# Altium project BCD_TO_7SEG_MODULE.PrjPcb (part 1 of 2)
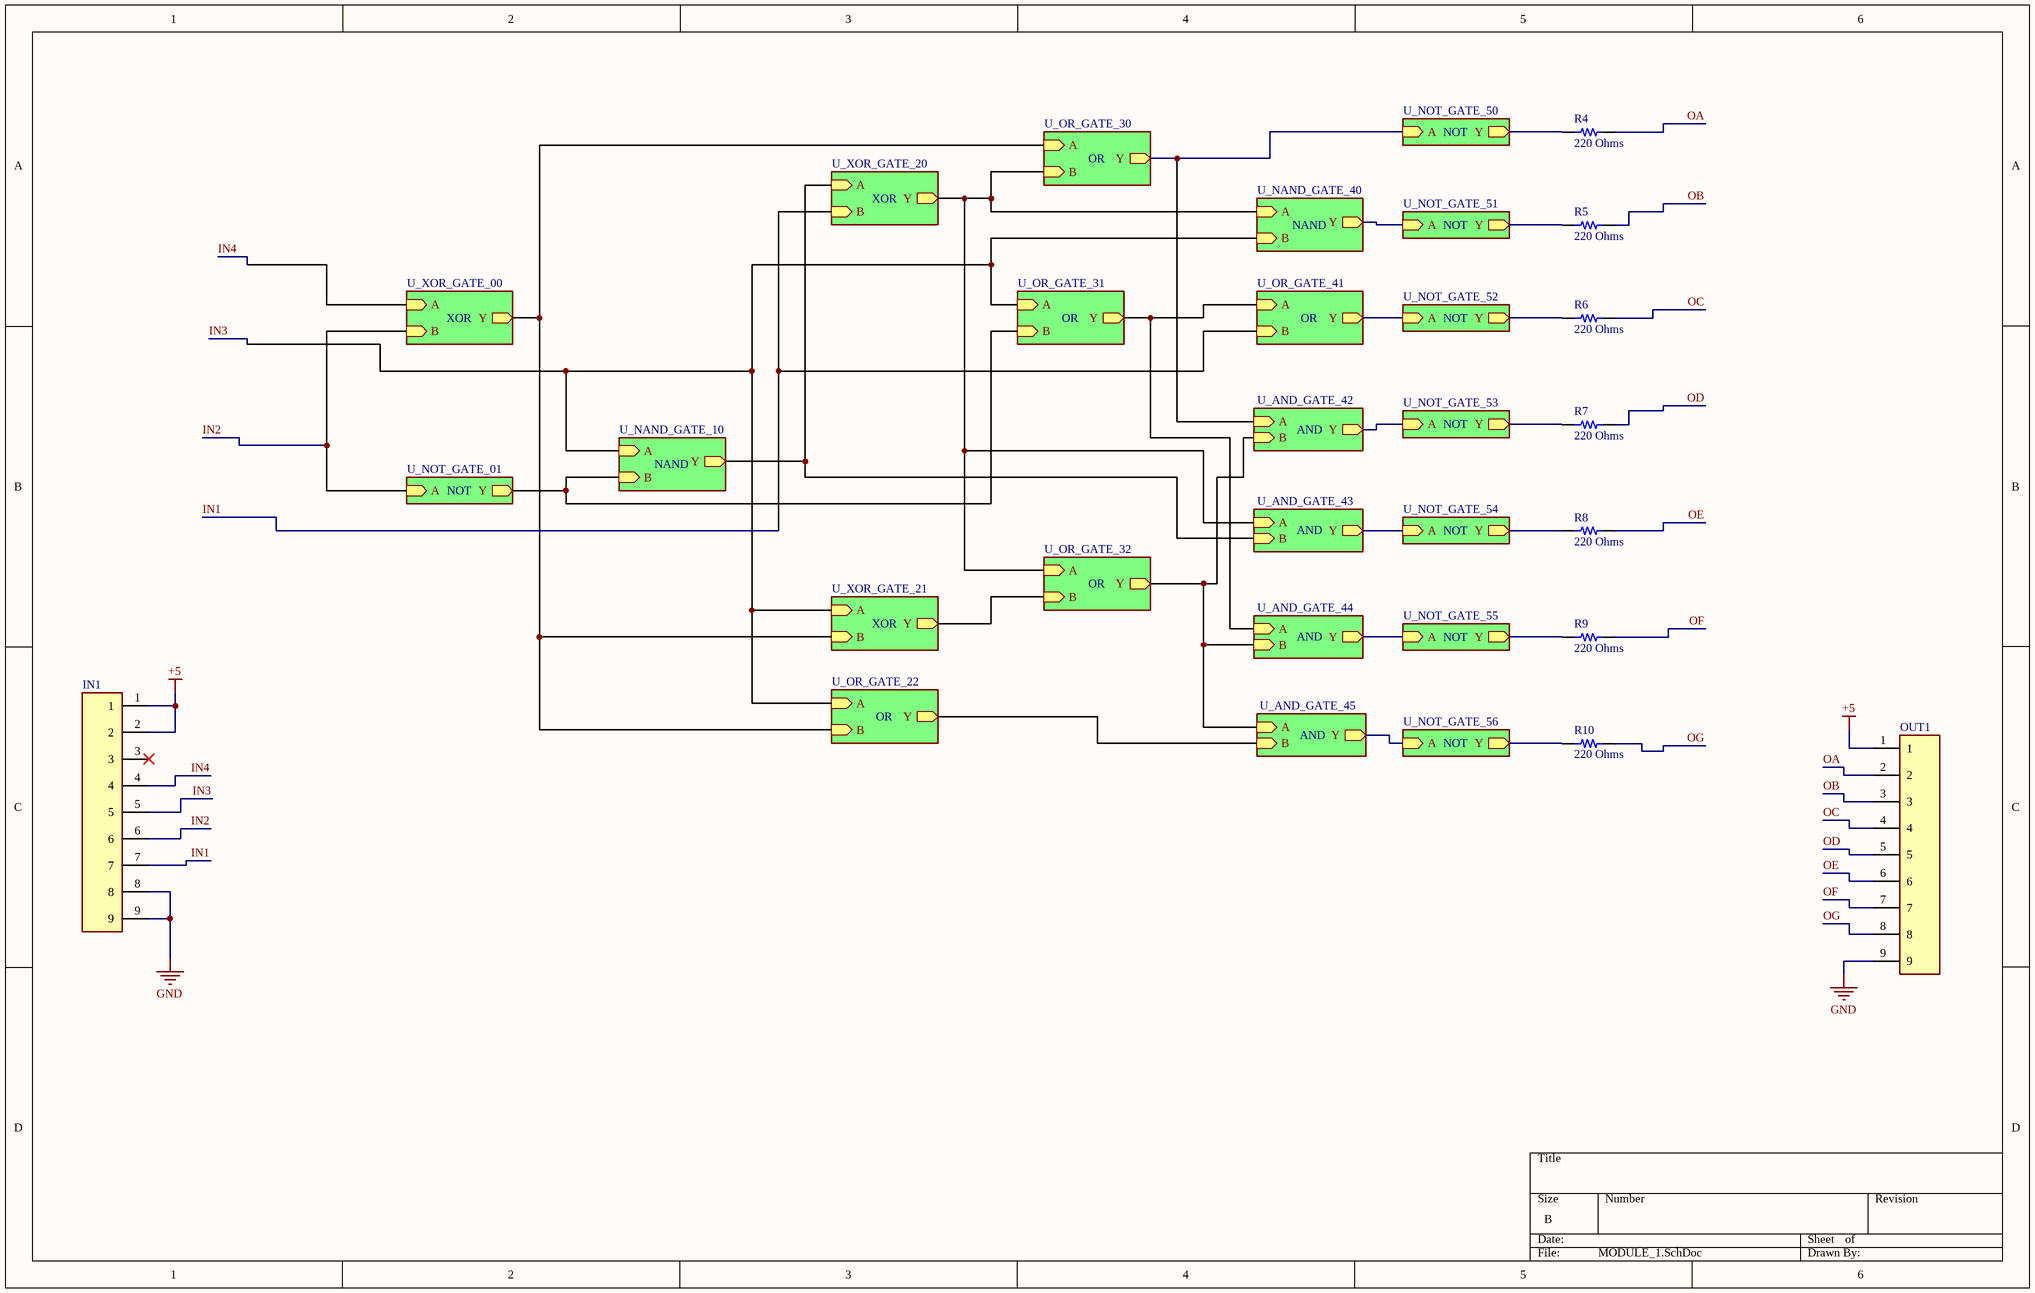
[diagram p0: MODULE_1.SchDoc]
6 sheets, 377 parts. Net scope: hierarchical (ports join the sheet entries above them; power ports are global).
Board file: PCB_V0.PcbDoc
Sheets:
  MODULE_1.SchDoc
    U_XOR_GATE_00 = XOR_GATE.SchDoc
    U_NOT_GATE_01 = NOT_GATE.SchDoc
    U_OR_GATE_22 = OR_GATE.SchDoc
    U_AND_GATE_42 = AND_GATE.SchDoc
    U_NAND_GATE_10 = NAND_GATE.SchDoc
    U_XOR_GATE_20 = XOR_GATE.SchDoc
    U_XOR_GATE_21 = XOR_GATE.SchDoc
    U_OR_GATE_30 = OR_GATE.SchDoc
    U_OR_GATE_31 = OR_GATE.SchDoc
    U_OR_GATE_32 = OR_GATE.SchDoc
    U_NAND_GATE_40 = NAND_GATE.SchDoc
    U_OR_GATE_41 = OR_GATE.SchDoc
    U_AND_GATE_43 = AND_GATE.SchDoc
    U_AND_GATE_44 = AND_GATE.SchDoc
    U_AND_GATE_45 = AND_GATE.SchDoc
    U_NOT_GATE_50 = NOT_GATE.SchDoc
    U_NOT_GATE_51 = NOT_GATE.SchDoc
    U_NOT_GATE_52 = NOT_GATE.SchDoc
    U_NOT_GATE_53 = NOT_GATE.SchDoc
    U_NOT_GATE_54 = NOT_GATE.SchDoc
    U_NOT_GATE_55 = NOT_GATE.SchDoc
    U_NOT_GATE_56 = NOT_GATE.SchDoc

## Sheet MODULE_1.SchDoc
size B

### Parts
IN1  2.54mm_TH_1x9_pin_header  [2.54mm_TH_1x9_pin_header]  (value not drawn)
OUT1  2.54mm_TH_1x9_pin_header  [2.54mm_TH_1x9_pin_header]  (value not drawn)
R4  220 Ohms  [RES 0603_1608]
R5  220 Ohms  [RES 0603_1608]
R6  220 Ohms  [RES 0603_1608]
R7  220 Ohms  [RES 0603_1608]
R8  220 Ohms  [RES 0603_1608]
R9  220 Ohms  [RES 0603_1608]
R10  220 Ohms  [RES 0603_1608]

### Sub-sheets
U_AND_GATE_42 = AND_GATE.SchDoc: Y (out), A (in), B (in)
U_AND_GATE_43 = AND_GATE.SchDoc: Y (out), A (in), B (in)
U_AND_GATE_44 = AND_GATE.SchDoc: Y (out), A (in), B (in)
U_AND_GATE_45 = AND_GATE.SchDoc: Y (out), A (in), B (in)
U_NAND_GATE_10 = NAND_GATE.SchDoc: Y (out), A (in), B (in)
U_NAND_GATE_40 = NAND_GATE.SchDoc: Y (out), A (in), B (in)
U_NOT_GATE_01 = NOT_GATE.SchDoc: Y (out), A (in)
U_NOT_GATE_50 = NOT_GATE.SchDoc: Y (out), A (in)
U_NOT_GATE_51 = NOT_GATE.SchDoc: Y (out), A (in)
U_NOT_GATE_52 = NOT_GATE.SchDoc: Y (out), A (in)
U_NOT_GATE_53 = NOT_GATE.SchDoc: Y (out), A (in)
U_NOT_GATE_54 = NOT_GATE.SchDoc: Y (out), A (in)
U_NOT_GATE_55 = NOT_GATE.SchDoc: Y (out), A (in)
U_NOT_GATE_56 = NOT_GATE.SchDoc: Y (out), A (in)
U_OR_GATE_22 = OR_GATE.SchDoc: Y (out), A (in), B (in)
U_OR_GATE_30 = OR_GATE.SchDoc: Y (out), A (in), B (in)
U_OR_GATE_31 = OR_GATE.SchDoc: Y (out), A (in), B (in)
U_OR_GATE_32 = OR_GATE.SchDoc: Y (out), A (in), B (in)
U_OR_GATE_41 = OR_GATE.SchDoc: Y (out), A (in), B (in)
U_XOR_GATE_00 = XOR_GATE.SchDoc: Y (out), A (in), B (in)
U_XOR_GATE_20 = XOR_GATE.SchDoc: Y (out), A (in), B (in)
U_XOR_GATE_21 = XOR_GATE.SchDoc: Y (out), A (in), B (in)

### Nets
+5: IN1.1 IN1.2 OUT1.1
GND: IN1.8 IN1.9 OUT1.9
IN1: IN1.7 ; sheet U_XOR_GATE_20/B, sheet U_OR_GATE_41/B
IN2: IN1.6 ; sheet U_XOR_GATE_00/B, sheet U_NOT_GATE_01/A
IN3: IN1.5 ; sheet U_OR_GATE_22/A, sheet U_NAND_GATE_10/A, sheet U_XOR_GATE_21/A, sheet U_OR_GATE_31/A, sheet U_NAND_GATE_40/B
IN4: IN1.4 ; sheet U_XOR_GATE_00/A
OA: OUT1.2 R4.2
OB: OUT1.3 R5.2
OC: OUT1.4 R6.2
OD: OUT1.5 R7.2
OE: OUT1.6 R8.2
OF: OUT1.7 R9.2
OG: OUT1.8 R10.2
NetAIN_R1_U_AND_GATE_42_2: sheet U_AND_GATE_42/A, sheet U_OR_GATE_30/Y, sheet U_NOT_GATE_50/A
NetAIN_R1_U_AND_GATE_43_2: sheet U_XOR_GATE_20/Y, sheet U_OR_GATE_30/B, sheet U_OR_GATE_32/A, sheet U_NAND_GATE_40/A, sheet U_AND_GATE_43/A
NetAIN_R1_U_AND_GATE_44_2: sheet U_OR_GATE_31/Y, sheet U_OR_GATE_41/A, sheet U_AND_GATE_44/A
NetAIN_R1_U_AND_GATE_45_2: sheet U_AND_GATE_42/B, sheet U_OR_GATE_32/Y, sheet U_AND_GATE_44/B, sheet U_AND_GATE_45/A
NetAIN_R2_U_OR_GATE_30_2: sheet U_XOR_GATE_00/Y, sheet U_OR_GATE_22/B, sheet U_XOR_GATE_21/B, sheet U_OR_GATE_30/A
NetAIN_R3_U_NOT_GATE_51_2: sheet U_NAND_GATE_40/Y, sheet U_NOT_GATE_51/A
NetAIN_R3_U_NOT_GATE_52_2: sheet U_OR_GATE_41/Y, sheet U_NOT_GATE_52/A
NetAIN_R3_U_NOT_GATE_53_2: sheet U_AND_GATE_42/Y, sheet U_NOT_GATE_53/A
NetAIN_R3_U_NOT_GATE_54_2: sheet U_AND_GATE_43/Y, sheet U_NOT_GATE_54/A
NetAIN_R3_U_NOT_GATE_55_2: sheet U_AND_GATE_44/Y, sheet U_NOT_GATE_55/A
NetAIN_R3_U_NOT_GATE_56_2: sheet U_AND_GATE_45/Y, sheet U_NOT_GATE_56/A
NetAIN_R4_U_XOR_GATE_20_2: sheet U_NAND_GATE_10/Y, sheet U_XOR_GATE_20/A, sheet U_AND_GATE_43/B
NetBIN_R1_U_AND_GATE_45_2: sheet U_OR_GATE_22/Y, sheet U_AND_GATE_45/B
NetBIN_R2_U_OR_GATE_31_2: sheet U_NOT_GATE_01/Y, sheet U_NAND_GATE_10/B, sheet U_OR_GATE_31/B
NetBIN_R2_U_OR_GATE_32_2: sheet U_XOR_GATE_21/Y, sheet U_OR_GATE_32/B
NetQ7_U_NOT_GATE_50_3: R4.1 ; sheet U_NOT_GATE_50/Y
NetQ7_U_NOT_GATE_51_3: R5.1 ; sheet U_NOT_GATE_51/Y
NetQ7_U_NOT_GATE_52_3: R6.1 ; sheet U_NOT_GATE_52/Y
NetQ7_U_NOT_GATE_53_3: R7.1 ; sheet U_NOT_GATE_53/Y
NetQ7_U_NOT_GATE_54_3: R8.1 ; sheet U_NOT_GATE_54/Y
NetQ7_U_NOT_GATE_55_3: R9.1 ; sheet U_NOT_GATE_55/Y
NetQ7_U_NOT_GATE_56_3: R10.1 ; sheet U_NOT_GATE_56/Y

Not connected (* = marked no-connect by the designer): IN1 3*

### Notes on the sheet
- OR
- NOT
- XOR
- NAND
- AND

### Library data of the parts
R4-R10 = ERA-3AED221V: RES SMD 220 OHM 0.5% 1/10W 0603; Manufacturer: Panasonic Electronic Components; Power (Watts): 0.1W, 1/10W; Temperature Coefficient: ±25ppm/°C; Part Number: ERA-3AED221V; Value: 220 Ohms; ComponentLink1Description: Datasheet; ComponentLink1URL: https://industrial.panasonic.com/cdbs/www-data/pdf/RDM0000/AOA0000C307.pdf; ComponentLink2Description: DigiKey Link; ComponentLink2URL: https://www.digikey.com/en/products/detail/panasonic-electronic-components/ERA-3AED221V/9373509; Composition: Thin Film; Device Package: 0603 (1608 Metric); Features: Automotive AEC-Q200; Height - Seated (Max): 0.022" (0.55mm); LastUpdated: 2/9/2024 8:43:36 PM; Lifecycle Status: Active; Minimum Order: 1; Number of Terminations: 2; Operating Temperature: -55°C ~ 155°C; Package / Case: 0603 (1608 Metric); Packaging: TapeAndReel; PartId: 4952; Part Status: Active; Price: 0.03; Ratings: AEC-Q200; Resistance: 220 Ohms; Series: ERA-3A; Size / Dimension: 0.063" L x 0.031" W (1.60mm x 0.80mm); Supplier 1: DigiKey; Supplier Part Number 1: P123752CT-ND; Supplier Device Package: 0603; Tolerance: ±0.5%

## Sheet XOR_GATE.SchDoc
size A
Used 3 times, as channels U_XOR_GATE_00, U_XOR_GATE_20, U_XOR_GATE_21. Parts and nets are listed once, with the designators drawn on the sheet.
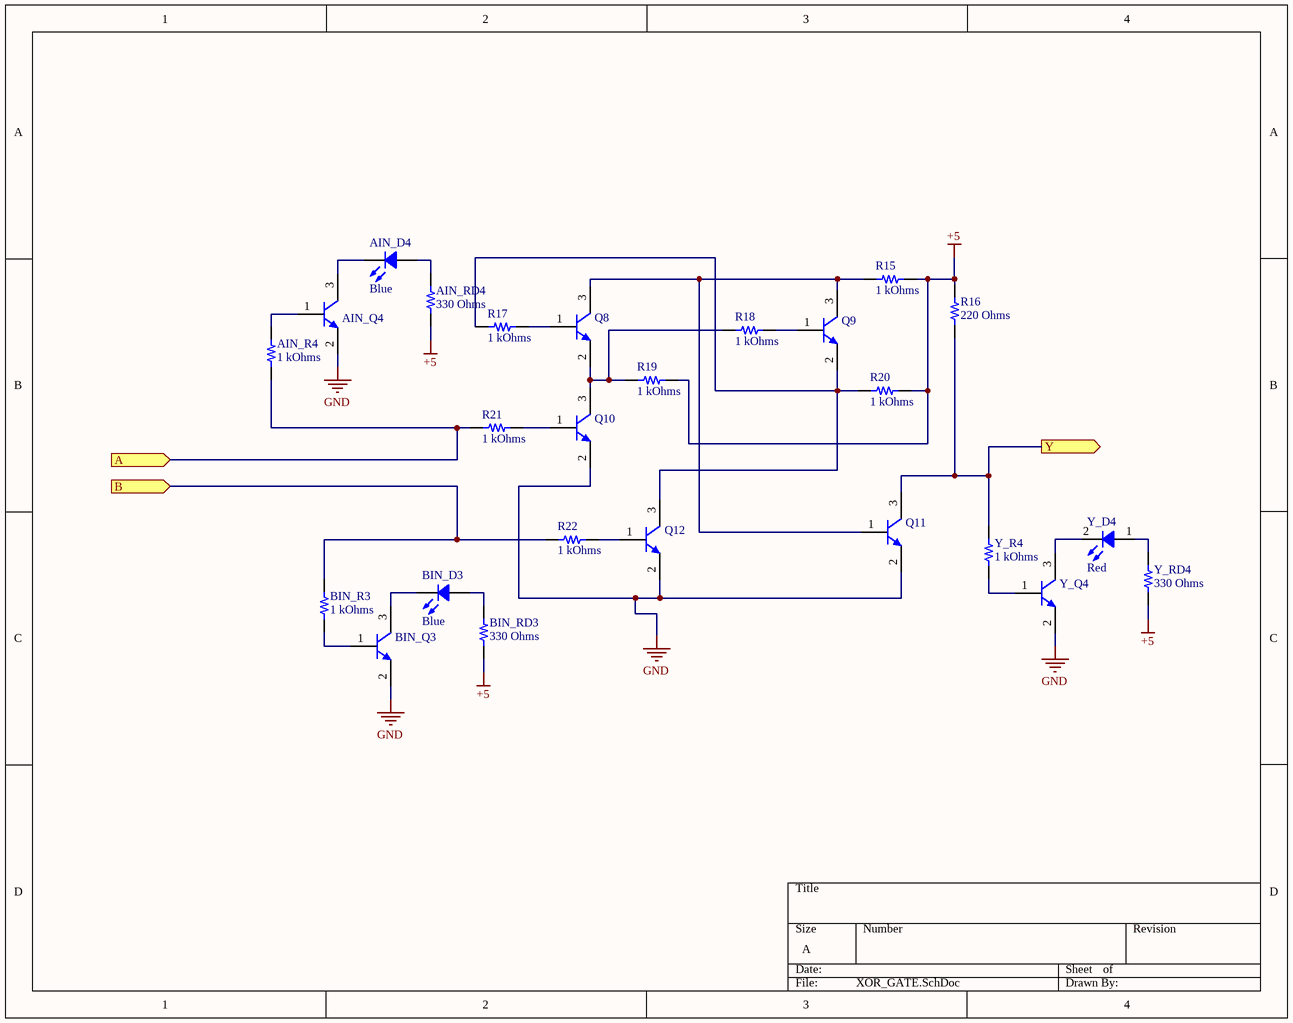
[diagram p1: XOR_GATE.SchDoc]

### Parts
AIN_D4  Blue  [LED 0603_1608 BLUE]
AIN_Q4  MMSS8050-L-TP  [MCCSEMI SOT-23-3]  (value not drawn)
AIN_R4  1 kOhms  [RES 0603_1608]
AIN_RD4  330 Ohms  [RES 0603_1608]
BIN_D3  Blue  [LED 0603_1608 BLUE]
BIN_Q3  MMSS8050-L-TP  [MCCSEMI SOT-23-3]  (value not drawn)
BIN_R3  1 kOhms  [RES 0603_1608]
BIN_RD3  330 Ohms  [RES 0603_1608]
Q8  MMSS8050-L-TP  [MCCSEMI SOT-23-3]  (value not drawn)
Q9  MMSS8050-L-TP  [MCCSEMI SOT-23-3]  (value not drawn)
Q10  MMSS8050-L-TP  [MCCSEMI SOT-23-3]  (value not drawn)
Q11  MMSS8050-L-TP  [MCCSEMI SOT-23-3]  (value not drawn)
Q12  MMSS8050-L-TP  [MCCSEMI SOT-23-3]  (value not drawn)
R15  1 kOhms  [RES 0603_1608]
R16  220 Ohms  [RES 0603_1608]
R17  1 kOhms  [RES 0603_1608]
R18  1 kOhms  [RES 0603_1608]
R19  1 kOhms  [RES 0603_1608]
R20  1 kOhms  [RES 0603_1608]
R21  1 kOhms  [RES 0603_1608]
R22  1 kOhms  [RES 0603_1608]
Y_D4  Red  [LED 0603_1608 RED]
Y_Q4  MMSS8050-L-TP  [MCCSEMI SOT-23-3]  (value not drawn)
Y_R4  1 kOhms  [RES 0603_1608]
Y_RD4  330 Ohms  [RES 0603_1608]

### Ports
A (in), B (in), Y (out)

### Nets
+5: AIN_RD4.1 BIN_RD3.1 R15.2 R16.2 R19.2 R20.2 Y_RD4.1
GND: AIN_Q4.2(E) BIN_Q3.2(E) Q10.2(E) Q11.2(E) Q12.2(E) Y_Q4.2(E)
A: AIN_R4.2 R21.1 ; port A
B: BIN_R3.2 R22.1 ; port B
Y: Q11.3(C) R16.1 Y_R4.2 ; port Y
NetAIN_D4_1: AIN_D4.1 AIN_RD4.2
NetAIN_D4_2: AIN_D4.2 AIN_Q4.3(C)
NetAIN_Q4_1: AIN_Q4.1(B) AIN_R4.1
NetBIN_D3_1: BIN_D3.1 BIN_RD3.2
NetBIN_D3_2: BIN_D3.2 BIN_Q3.3(C)
NetBIN_Q3_1: BIN_Q3.1(B) BIN_R3.1
NetQ8_1: Q8.1(B) R17.2
NetQ8_2: Q8.2(E) Q10.3(C) R18.1 R19.1
NetQ8_3: Q8.3(C) Q9.3(C) Q11.1(B) R15.1
NetQ9_1: Q9.1(B) R18.2
NetQ9_2: Q9.2(E) Q12.3(C) R17.1 R20.1
NetQ10_1: Q10.1(B) R21.2
NetQ12_1: Q12.1(B) R22.2
NetY_D4_1: Y_D4.1 Y_RD4.2
NetY_D4_2: Y_D4.2 Y_Q4.3(C)
NetY_Q4_1: Y_Q4.1(B) Y_R4.1

### Channels
U_XOR_GATE_00: designators end in _U_XOR_GATE_00; ports A=IN4 B=IN2 Y=NetAIN_R2_U_OR_GATE_30_2
U_XOR_GATE_20: designators end in _U_XOR_GATE_20; ports A=NetAIN_R4_U_XOR_GATE_20_2 B=IN1 Y=NetAIN_R1_U_AND_GATE_43_2
U_XOR_GATE_21: designators end in _U_XOR_GATE_21; ports A=IN3 B=NetAIN_R2_U_OR_GATE_30_2 Y=NetBIN_R2_U_OR_GATE_32_2

### Library data of the parts
AIN_D4 BIN_D3 = IN-S63AT5B: LED BLUE CLEAR 0603 SMD; Manufacturer: Inolux; Configuration: Standard; Current - Test: 5mA; Lens Size: 1.15mm x 0.80mm; Lens Style: Rectangle with Flat Top; Millicandela Rating: 45mcd; Viewing Angle: 120°; Voltage - Forward (Vf) (Typ): 2.8V; Wavelength - Dominant: 470nm; Wavelength - Peak: 468nm; Part Number: IN-S63AT5B; Color: Blue; ComponentLink1Description: Datasheet; ComponentLink1URL: http://www.inolux-corp.com/datasheet/SMDLED/Mono%20Color%20Top%20View/IN-S63AT%20Series_V1.1.pdf; ComponentLink2Description: DigiKey Link; ComponentLink2URL: https://www.digikey.com/en/products/detail/inolux/IN-S63AT5B/7604929; Device Package: 0603 (1608 Metric); Height (Max): 0.40mm; LastUpdated: 6/3/2024 7:57:52 PM; Lens Color: Clear; Lens Transparency: Clear; Lifecycle Status: Active; Minimum Order: 1; Mounting Type: Surface Mount; Package / Case: 0603 (1608 Metric); Packaging: TapeAndReel; PartId: 834; Part Status: Active; Price: 0.03; Series: IN-S63AT; Size / Dimension: 1.60mm L x 0.80mm W; Supplier 1: DigiKey; Supplier Part Number 1: 1830-1061-1-ND; Supplier Device Package: 0603; Value: Blue
AIN_Q4 BIN_Q3 Q8-Q12 Y_Q4 = MMSS8050-L-TP: TRANS NPN 25V 1.5A SOT23; Manufacturer: Micro Commercial Co; Current - Collector Cutoff (Max): 100nA; DC Current Gain (hFE) (Min) @ Ic, Vce: 120 @ 100mA, 1V; Frequency - Transition: 100MHz; Power - Max: 625 mW; Vce Saturation (Max) @ Ib, Ic: 500mV @ 80mA, 800mA; Part Number: MMSS8050-L-TP; ComponentLink1Description: Datasheet; ComponentLink1URL: https://www.mccsemi.com/pdf/Products/MMSS8050(SOT-23).pdf; ComponentLink2Description: DigiKey Link; ComponentLink2URL: https://www.digikey.com/en/products/detail/micro-commercial-co/MMSS8050-L-TP/2827197; Current - Collector (Ic) (Max): 1.5 A; LastUpdated: 6/3/2024 8:24:16 PM; Lifecycle Status: Active; Minimum Order: 1; Mounting Type: Surface Mount; Operating Temperature: -55°C ~ 150°C (TJ); Package / Case: TO-236-3, SC-59, SOT-23-3; Packaging: TapeAndReel; PartId: 278; Part Status: Active; Price: 0.01; Series: -; Supplier 1: DigiKey; Supplier Part Number 1: MMSS8050-L-TPMSCT-ND; Supplier Device Package: SOT-23; Transistor Type: NPN; Voltage - Collector Emitter Breakdown (Max): 25 V
AIN_R4 BIN_R3 R15 R17-R22 Y_R4 = CPF0603B1K0E: RES SMD 1K OHM 0.1% 1/16W 0603; Manufacturer: TE Connectivity Passive Product; Power (Watts): 0.063W, 1/16W; Temperature Coefficient: ±25ppm/°C; Part Number: CPF0603B1K0E; Value: 1 kOhms; ComponentLink1Description: Datasheet; ComponentLink1URL: https://www.te.com/commerce/DocumentDelivery/DDEController?Action=srchrtrv&DocNm=1773200&DocType=DS&DocLang=English; ComponentLink2Description: DigiKey Link; ComponentLink2URL: https://www.digikey.com/en/products/detail/te-connectivity-passive-product/CPF0603B1K0E/2390473; Composition: Thin Film; Device Package: 0603 (1608 Metric); Height - Seated (Max): 0.022" (0.55mm); LastUpdated: 2/9/2024 8:43:37 PM; Lifecycle Status: Active; Minimum Order: 1; Number of Terminations: 2; Operating Temperature: -55°C ~ 155°C; Package / Case: 0603 (1608 Metric); Packaging: TapeAndReel; PartId: 4877; Part Status: Active; Price: 0.09; Resistance: 1 kOhms; Series: CPF, Neohm; Size / Dimension: 0.061" L x 0.031" W (1.55mm x 0.80mm); Supplier 1: DigiKey; Supplier Part Number 1: A119887CT-ND; Supplier Device Package: 0603; Tolerance: ±0.1%
AIN_RD4 BIN_RD3 Y_RD4 = RMCF0603JT330R: RES 330 OHM 5% 1/10W 0603; Manufacturer: Stackpole Electronics Inc; Power (Watts): 0.1W, 1/10W; Temperature Coefficient: ±200ppm/°C; Part Number: RMCF0603JT330R; Value: 330 Ohms; ComponentLink1Description: Datasheet; ComponentLink1URL: https://www.seielect.com/catalog/sei-rmcf_rmcp.pdf; ComponentLink2Description: DigiKey Link; ComponentLink2URL: https://www.digikey.com/en/products/detail/stackpole-electronics-inc/RMCF0603JT330R/1757998; Composition: Thick Film; Device Package: 0603 (1608 Metric); Features: Automotive AEC-Q200; Height - Seated (Max): 0.022" (0.55mm); LastUpdated: 2/9/2024 8:43:33 PM; Lifecycle Status: Active; Minimum Order: 1; Number of Terminations: 2; Operating Temperature: -55°C ~ 155°C; Package / Case: 0603 (1608 Metric); Packaging: CutTape; PartId: 5841; Part Status: Active; Price: 0.01; Ratings: AEC-Q200; Resistance: 330 Ohms; Series: RMCF; Size / Dimension: 0.061" L x 0.031" W (1.55mm x 0.80mm); Supplier 1: DigiKey; Supplier Part Number 1: RMCF0603JT330RCT-ND; Supplier Device Package: 0603; Tolerance: ±5%
R16 = ERA-3AED221V: as R4 on sheet MODULE_1; Part Number: ERA-3AED221V; Value: 220 Ohms; ComponentLink1Description: Datasheet; ComponentLink1URL: https://industrial.panasonic.com/cdbs/www-data/pdf/RDM0000/AOA0000C307.pdf; ComponentLink2Description: DigiKey Link; ComponentLink2URL: https://www.digikey.com/en/products/detail/panasonic-electronic-components/ERA-3AED221V/9373509; Composition: Thin Film; Device Package: 0603 (1608 Metric); Features: Automotive AEC-Q200; Height - Seated (Max): 0.022" (0.55mm); LastUpdated: 2/9/2024 8:43:36 PM; Lifecycle Status: Active; Minimum Order: 1; Number of Terminations: 2; Operating Temperature: -55°C ~ 155°C; Package / Case: 0603 (1608 Metric); Packaging: TapeAndReel; PartId: 4952; Part Status: Active; Price: 0.03; Ratings: AEC-Q200; Resistance: 220 Ohms; Series: ERA-3A; Size / Dimension: 0.063" L x 0.031" W (1.60mm x 0.80mm); Supplier 1: DigiKey; Supplier Part Number 1: P123752CT-ND; Supplier Device Package: 0603; Tolerance: ±0.5%
Y_D4 = XZMDK53W-8: LED RED CLEAR CHIP SMD; Manufacturer: SunLED; Configuration: Standard; Current - Test: 20mA; Lens Color: Colorless; Lens Size: 0.35mm Dia; Lens Style: Round with Domed Top; Millicandela Rating: 248mcd; Viewing Angle: 60°; Voltage - Forward (Vf) (Typ): 1.95V; Wavelength - Dominant: 630nm; Wavelength - Peak: 645nm; Part Number: XZMDK53W-8; Color: Red; ComponentLink1Description: Datasheet; ComponentLink1URL: https://www.sunledusa.com/products/spec/XZMDK53W-8.pdf; ComponentLink2Description: DigiKey Link; ComponentLink2URL: https://www.digikey.com/en/products/detail/sunled/XZMDK53W-8/4745952; Device Package: 0603 (1608 Metric); Height (Max): 0.95mm; LastUpdated: 6/3/2024 7:59:48 PM; Lens Transparency: Clear; Lifecycle Status: Active; Minimum Order: 1; Mounting Type: Surface Mount; Package / Case: 0603 (1608 Metric); Packaging: TapeAndReel; PartId: 401; Part Status: Active; Price: 0.06; Series: PixsoLED; Size / Dimension: 1.60mm L x 0.80mm W; Supplier 1: DigiKey; Supplier Part Number 1: 1497-1169-6-ND; Supplier Device Package: Chip LED; Value: Red

## Sheet NOT_GATE.SchDoc
size A
Used 8 times, as channels U_NOT_GATE_01, U_NOT_GATE_50, U_NOT_GATE_51, U_NOT_GATE_52, U_NOT_GATE_53, U_NOT_GATE_54, U_NOT_GATE_55, U_NOT_GATE_56. Parts and nets are listed once, with the designators drawn on the sheet.
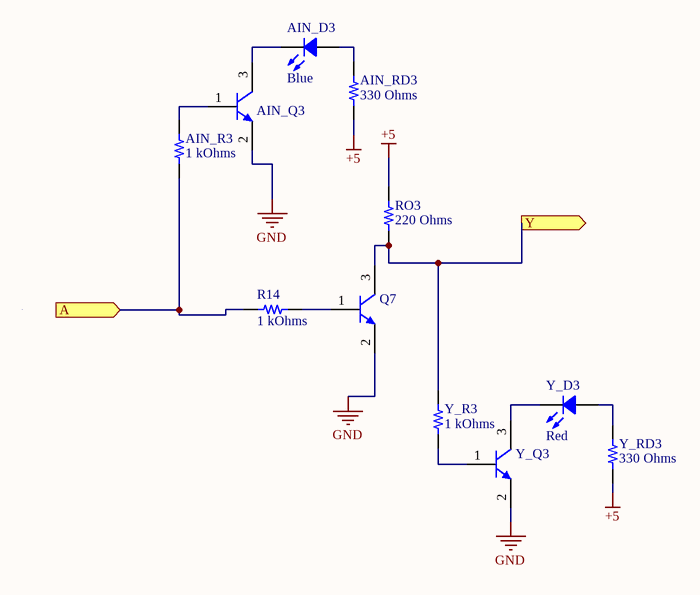
[diagram p2: NOT_GATE.SchDoc]

### Parts
AIN_D3  Blue  [LED 0603_1608 BLUE]
AIN_Q3  MMSS8050-L-TP  [MCCSEMI SOT-23-3]  (value not drawn)
AIN_R3  1 kOhms  [RES 0603_1608]
AIN_RD3  330 Ohms  [RES 0603_1608]
Q7  MMSS8050-L-TP  [MCCSEMI SOT-23-3]  (value not drawn)
R14  1 kOhms  [RES 0603_1608]
RO3  220 Ohms  [RES 0603_1608]
Y_D3  Red  [LED 0603_1608 RED]
Y_Q3  MMSS8050-L-TP  [MCCSEMI SOT-23-3]  (value not drawn)
Y_R3  1 kOhms  [RES 0603_1608]
Y_RD3  330 Ohms  [RES 0603_1608]

### Ports
A (in), Y (out)

### Nets
+5: AIN_RD3.1 RO3.2 Y_RD3.1
GND: AIN_Q3.2(E) Q7.2(E) Y_Q3.2(E)
A: AIN_R3.2 R14.1 ; port A
Y: Q7.3(C) RO3.1 Y_R3.2 ; port Y
NetAIN_D3_1: AIN_D3.1 AIN_RD3.2
NetAIN_D3_2: AIN_D3.2 AIN_Q3.3(C)
NetAIN_Q3_1: AIN_Q3.1(B) AIN_R3.1
NetQ7_1: Q7.1(B) R14.2
NetY_D3_1: Y_D3.1 Y_RD3.2
NetY_D3_2: Y_D3.2 Y_Q3.3(C)
NetY_Q3_1: Y_Q3.1(B) Y_R3.1

### Channels
U_NOT_GATE_01: designators end in _U_NOT_GATE_01; ports A=IN2 Y=NetBIN_R2_U_OR_GATE_31_2
U_NOT_GATE_50: designators end in _U_NOT_GATE_50; ports A=NetAIN_R1_U_AND_GATE_42_2 Y=NetQ7_U_NOT_GATE_50_3
U_NOT_GATE_51: designators end in _U_NOT_GATE_51; ports A=NetAIN_R3_U_NOT_GATE_51_2 Y=NetQ7_U_NOT_GATE_51_3
U_NOT_GATE_52: designators end in _U_NOT_GATE_52; ports A=NetAIN_R3_U_NOT_GATE_52_2 Y=NetQ7_U_NOT_GATE_52_3
U_NOT_GATE_53: designators end in _U_NOT_GATE_53; ports A=NetAIN_R3_U_NOT_GATE_53_2 Y=NetQ7_U_NOT_GATE_53_3
U_NOT_GATE_54: designators end in _U_NOT_GATE_54; ports A=NetAIN_R3_U_NOT_GATE_54_2 Y=NetQ7_U_NOT_GATE_54_3
U_NOT_GATE_55: designators end in _U_NOT_GATE_55; ports A=NetAIN_R3_U_NOT_GATE_55_2 Y=NetQ7_U_NOT_GATE_55_3
U_NOT_GATE_56: designators end in _U_NOT_GATE_56; ports A=NetAIN_R3_U_NOT_GATE_56_2 Y=NetQ7_U_NOT_GATE_56_3

### Library data of the parts
AIN_D3 = IN-S63AT5B: as AIN_D4 on sheet XOR_GATE; Part Number: IN-S63AT5B; Color: Blue; ComponentLink1Description: Datasheet; ComponentLink1URL: http://www.inolux-corp.com/datasheet/SMDLED/Mono%20Color%20Top%20View/IN-S63AT%20Series_V1.1.pdf; ComponentLink2Description: DigiKey Link; ComponentLink2URL: https://www.digikey.com/en/products/detail/inolux/IN-S63AT5B/7604929; Device Package: 0603 (1608 Metric); Height (Max): 0.40mm; LastUpdated: 6/3/2024 7:57:52 PM; Lens Color: Clear; Lens Transparency: Clear; Lifecycle Status: Active; Minimum Order: 1; Mounting Type: Surface Mount; Package / Case: 0603 (1608 Metric); Packaging: TapeAndReel; PartId: 834; Part Status: Active; Price: 0.03; Series: IN-S63AT; Size / Dimension: 1.60mm L x 0.80mm W; Supplier 1: DigiKey; Supplier Part Number 1: 1830-1061-1-ND; Supplier Device Package: 0603; Value: Blue
AIN_Q3 Q7 Y_Q3 = MMSS8050-L-TP: as AIN_Q4 on sheet XOR_GATE; Part Number: MMSS8050-L-TP; ComponentLink1Description: Datasheet; ComponentLink1URL: https://www.mccsemi.com/pdf/Products/MMSS8050(SOT-23).pdf; ComponentLink2Description: DigiKey Link; ComponentLink2URL: https://www.digikey.com/en/products/detail/micro-commercial-co/MMSS8050-L-TP/2827197; Current - Collector (Ic) (Max): 1.5 A; LastUpdated: 6/3/2024 8:24:16 PM; Lifecycle Status: Active; Minimum Order: 1; Mounting Type: Surface Mount; Operating Temperature: -55°C ~ 150°C (TJ); Package / Case: TO-236-3, SC-59, SOT-23-3; Packaging: TapeAndReel; PartId: 278; Part Status: Active; Price: 0.01; Series: -; Supplier 1: DigiKey; Supplier Part Number 1: MMSS8050-L-TPMSCT-ND; Supplier Device Package: SOT-23; Transistor Type: NPN; Voltage - Collector Emitter Breakdown (Max): 25 V
AIN_R3 R14 Y_R3 = CPF0603B1K0E: as AIN_R4 on sheet XOR_GATE; Part Number: CPF0603B1K0E; Value: 1 kOhms; ComponentLink1Description: Datasheet; ComponentLink1URL: https://www.te.com/commerce/DocumentDelivery/DDEController?Action=srchrtrv&DocNm=1773200&DocType=DS&DocLang=English; ComponentLink2Description: DigiKey Link; ComponentLink2URL: https://www.digikey.com/en/products/detail/te-connectivity-passive-product/CPF0603B1K0E/2390473; Composition: Thin Film; Device Package: 0603 (1608 Metric); Height - Seated (Max): 0.022" (0.55mm); LastUpdated: 2/9/2024 8:43:37 PM; Lifecycle Status: Active; Minimum Order: 1; Number of Terminations: 2; Operating Temperature: -55°C ~ 155°C; Package / Case: 0603 (1608 Metric); Packaging: TapeAndReel; PartId: 4877; Part Status: Active; Price: 0.09; Resistance: 1 kOhms; Series: CPF, Neohm; Size / Dimension: 0.061" L x 0.031" W (1.55mm x 0.80mm); Supplier 1: DigiKey; Supplier Part Number 1: A119887CT-ND; Supplier Device Package: 0603; Tolerance: ±0.1%
AIN_RD3 Y_RD3 = RMCF0603JT330R: as AIN_RD4 on sheet XOR_GATE; Part Number: RMCF0603JT330R; Value: 330 Ohms; ComponentLink1Description: Datasheet; ComponentLink1URL: https://www.seielect.com/catalog/sei-rmcf_rmcp.pdf; ComponentLink2Description: DigiKey Link; ComponentLink2URL: https://www.digikey.com/en/products/detail/stackpole-electronics-inc/RMCF0603JT330R/1757998; Composition: Thick Film; Device Package: 0603 (1608 Metric); Features: Automotive AEC-Q200; Height - Seated (Max): 0.022" (0.55mm); LastUpdated: 2/9/2024 8:43:33 PM; Lifecycle Status: Active; Minimum Order: 1; Number of Terminations: 2; Operating Temperature: -55°C ~ 155°C; Package / Case: 0603 (1608 Metric); Packaging: CutTape; PartId: 5841; Part Status: Active; Price: 0.01; Ratings: AEC-Q200; Resistance: 330 Ohms; Series: RMCF; Size / Dimension: 0.061" L x 0.031" W (1.55mm x 0.80mm); Supplier 1: DigiKey; Supplier Part Number 1: RMCF0603JT330RCT-ND; Supplier Device Package: 0603; Tolerance: ±5%
RO3 = ERA-3AED221V: as R4 on sheet MODULE_1; Part Number: ERA-3AED221V; Value: 220 Ohms; ComponentLink1Description: Datasheet; ComponentLink1URL: https://industrial.panasonic.com/cdbs/www-data/pdf/RDM0000/AOA0000C307.pdf; ComponentLink2Description: DigiKey Link; ComponentLink2URL: https://www.digikey.com/en/products/detail/panasonic-electronic-components/ERA-3AED221V/9373509; Composition: Thin Film; Device Package: 0603 (1608 Metric); Features: Automotive AEC-Q200; Height - Seated (Max): 0.022" (0.55mm); LastUpdated: 2/9/2024 8:43:36 PM; Lifecycle Status: Active; Minimum Order: 1; Number of Terminations: 2; Operating Temperature: -55°C ~ 155°C; Package / Case: 0603 (1608 Metric); Packaging: TapeAndReel; PartId: 4952; Part Status: Active; Price: 0.03; Ratings: AEC-Q200; Resistance: 220 Ohms; Series: ERA-3A; Size / Dimension: 0.063" L x 0.031" W (1.60mm x 0.80mm); Supplier 1: DigiKey; Supplier Part Number 1: P123752CT-ND; Supplier Device Package: 0603; Tolerance: ±0.5%
Y_D3 = XZMDK53W-8: as Y_D4 on sheet XOR_GATE; Part Number: XZMDK53W-8; Color: Red; ComponentLink1Description: Datasheet; ComponentLink1URL: https://www.sunledusa.com/products/spec/XZMDK53W-8.pdf; ComponentLink2Description: DigiKey Link; ComponentLink2URL: https://www.digikey.com/en/products/detail/sunled/XZMDK53W-8/4745952; Device Package: 0603 (1608 Metric); Height (Max): 0.95mm; LastUpdated: 6/3/2024 7:59:48 PM; Lens Transparency: Clear; Lifecycle Status: Active; Minimum Order: 1; Mounting Type: Surface Mount; Package / Case: 0603 (1608 Metric); Packaging: TapeAndReel; PartId: 401; Part Status: Active; Price: 0.06; Series: PixsoLED; Size / Dimension: 1.60mm L x 0.80mm W; Supplier 1: DigiKey; Supplier Part Number 1: 1497-1169-6-ND; Supplier Device Package: Chip LED; Value: Red

## Sheet OR_GATE.SchDoc
size A
Used 5 times, as channels U_OR_GATE_22, U_OR_GATE_30, U_OR_GATE_31, U_OR_GATE_32, U_OR_GATE_41. Parts and nets are listed once, with the designators drawn on the sheet.
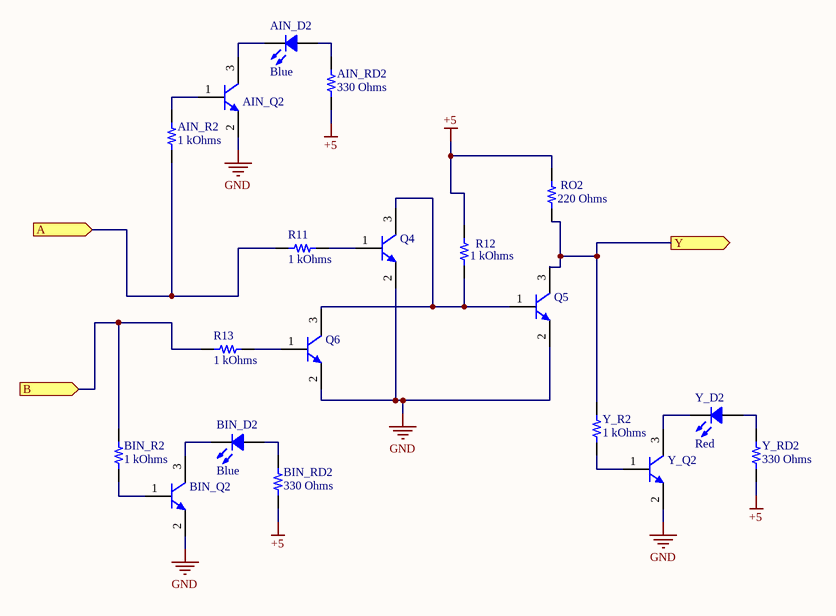
[diagram p3: OR_GATE.SchDoc]

### Parts
AIN_D2  Blue  [LED 0603_1608 BLUE]
AIN_Q2  MMSS8050-L-TP  [MCCSEMI SOT-23-3]  (value not drawn)
AIN_R2  1 kOhms  [RES 0603_1608]
AIN_RD2  330 Ohms  [RES 0603_1608]
BIN_D2  Blue  [LED 0603_1608 BLUE]
BIN_Q2  MMSS8050-L-TP  [MCCSEMI SOT-23-3]  (value not drawn)
BIN_R2  1 kOhms  [RES 0603_1608]
BIN_RD2  330 Ohms  [RES 0603_1608]
Q4  MMSS8050-L-TP  [MCCSEMI SOT-23-3]  (value not drawn)
Q5  MMSS8050-L-TP  [MCCSEMI SOT-23-3]  (value not drawn)
Q6  MMSS8050-L-TP  [MCCSEMI SOT-23-3]  (value not drawn)
R11  1 kOhms  [RES 0603_1608]
R12  1 kOhms  [RES 0603_1608]
R13  1 kOhms  [RES 0603_1608]
RO2  220 Ohms  [RES 0603_1608]
Y_D2  Red  [LED 0603_1608 RED]
Y_Q2  MMSS8050-L-TP  [MCCSEMI SOT-23-3]  (value not drawn)
Y_R2  1 kOhms  [RES 0603_1608]
Y_RD2  330 Ohms  [RES 0603_1608]

### Ports
A (in), B (in), Y (out)

### Nets
+5: AIN_RD2.1 BIN_RD2.1 R12.2 RO2.2 Y_RD2.1
GND: AIN_Q2.2(E) BIN_Q2.2(E) Q4.2(E) Q5.2(E) Q6.2(E) Y_Q2.2(E)
A: AIN_R2.2 R11.1 ; port A
B: BIN_R2.2 R13.1 ; port B
Y: Q5.3(C) RO2.1 Y_R2.2 ; port Y
NetAIN_D2_1: AIN_D2.1 AIN_RD2.2
NetAIN_D2_2: AIN_D2.2 AIN_Q2.3(C)
NetAIN_Q2_1: AIN_Q2.1(B) AIN_R2.1
NetBIN_D2_1: BIN_D2.1 BIN_RD2.2
NetBIN_D2_2: BIN_D2.2 BIN_Q2.3(C)
NetBIN_Q2_1: BIN_Q2.1(B) BIN_R2.1
NetQ4_1: Q4.1(B) R11.2
NetQ4_3: Q4.3(C) Q5.1(B) Q6.3(C) R12.1
NetQ6_1: Q6.1(B) R13.2
NetY_D2_1: Y_D2.1 Y_RD2.2
NetY_D2_2: Y_D2.2 Y_Q2.3(C)
NetY_Q2_1: Y_Q2.1(B) Y_R2.1

### Channels
U_OR_GATE_22: designators end in _U_OR_GATE_22; ports A=IN3 B=NetAIN_R2_U_OR_GATE_30_2 Y=NetBIN_R1_U_AND_GATE_45_2
U_OR_GATE_30: designators end in _U_OR_GATE_30; ports A=NetAIN_R2_U_OR_GATE_30_2 B=NetAIN_R1_U_AND_GATE_43_2 Y=NetAIN_R1_U_AND_GATE_42_2
U_OR_GATE_31: designators end in _U_OR_GATE_31; ports A=IN3 B=NetBIN_R2_U_OR_GATE_31_2 Y=NetAIN_R1_U_AND_GATE_44_2
U_OR_GATE_32: designators end in _U_OR_GATE_32; ports A=NetAIN_R1_U_AND_GATE_43_2 B=NetBIN_R2_U_OR_GATE_32_2 Y=NetAIN_R1_U_AND_GATE_45_2
U_OR_GATE_41: designators end in _U_OR_GATE_41; ports A=NetAIN_R1_U_AND_GATE_44_2 B=IN1 Y=NetAIN_R3_U_NOT_GATE_52_2

### Library data of the parts
AIN_D2 BIN_D2 = IN-S63AT5B: as AIN_D4 on sheet XOR_GATE; Part Number: IN-S63AT5B; Color: Blue; ComponentLink1Description: Datasheet; ComponentLink1URL: http://www.inolux-corp.com/datasheet/SMDLED/Mono%20Color%20Top%20View/IN-S63AT%20Series_V1.1.pdf; ComponentLink2Description: DigiKey Link; ComponentLink2URL: https://www.digikey.com/en/products/detail/inolux/IN-S63AT5B/7604929; Device Package: 0603 (1608 Metric); Height (Max): 0.40mm; LastUpdated: 6/3/2024 7:57:52 PM; Lens Color: Clear; Lens Transparency: Clear; Lifecycle Status: Active; Minimum Order: 1; Mounting Type: Surface Mount; Package / Case: 0603 (1608 Metric); Packaging: TapeAndReel; PartId: 834; Part Status: Active; Price: 0.03; Series: IN-S63AT; Size / Dimension: 1.60mm L x 0.80mm W; Supplier 1: DigiKey; Supplier Part Number 1: 1830-1061-1-ND; Supplier Device Package: 0603; Value: Blue
AIN_Q2 BIN_Q2 Q4-Q6 Y_Q2 = MMSS8050-L-TP: as AIN_Q4 on sheet XOR_GATE; Part Number: MMSS8050-L-TP; ComponentLink1Description: Datasheet; ComponentLink1URL: https://www.mccsemi.com/pdf/Products/MMSS8050(SOT-23).pdf; ComponentLink2Description: DigiKey Link; ComponentLink2URL: https://www.digikey.com/en/products/detail/micro-commercial-co/MMSS8050-L-TP/2827197; Current - Collector (Ic) (Max): 1.5 A; LastUpdated: 6/3/2024 8:24:16 PM; Lifecycle Status: Active; Minimum Order: 1; Mounting Type: Surface Mount; Operating Temperature: -55°C ~ 150°C (TJ); Package / Case: TO-236-3, SC-59, SOT-23-3; Packaging: TapeAndReel; PartId: 278; Part Status: Active; Price: 0.01; Series: -; Supplier 1: DigiKey; Supplier Part Number 1: MMSS8050-L-TPMSCT-ND; Supplier Device Package: SOT-23; Transistor Type: NPN; Voltage - Collector Emitter Breakdown (Max): 25 V
AIN_R2 BIN_R2 R11-R13 Y_R2 = CPF0603B1K0E: as AIN_R4 on sheet XOR_GATE; Part Number: CPF0603B1K0E; Value: 1 kOhms; ComponentLink1Description: Datasheet; ComponentLink1URL: https://www.te.com/commerce/DocumentDelivery/DDEController?Action=srchrtrv&DocNm=1773200&DocType=DS&DocLang=English; ComponentLink2Description: DigiKey Link; ComponentLink2URL: https://www.digikey.com/en/products/detail/te-connectivity-passive-product/CPF0603B1K0E/2390473; Composition: Thin Film; Device Package: 0603 (1608 Metric); Height - Seated (Max): 0.022" (0.55mm); LastUpdated: 2/9/2024 8:43:37 PM; Lifecycle Status: Active; Minimum Order: 1; Number of Terminations: 2; Operating Temperature: -55°C ~ 155°C; Package / Case: 0603 (1608 Metric); Packaging: TapeAndReel; PartId: 4877; Part Status: Active; Price: 0.09; Resistance: 1 kOhms; Series: CPF, Neohm; Size / Dimension: 0.061" L x 0.031" W (1.55mm x 0.80mm); Supplier 1: DigiKey; Supplier Part Number 1: A119887CT-ND; Supplier Device Package: 0603; Tolerance: ±0.1%
AIN_RD2 BIN_RD2 Y_RD2 = RMCF0603JT330R: as AIN_RD4 on sheet XOR_GATE; Part Number: RMCF0603JT330R; Value: 330 Ohms; ComponentLink1Description: Datasheet; ComponentLink1URL: https://www.seielect.com/catalog/sei-rmcf_rmcp.pdf; ComponentLink2Description: DigiKey Link; ComponentLink2URL: https://www.digikey.com/en/products/detail/stackpole-electronics-inc/RMCF0603JT330R/1757998; Composition: Thick Film; Device Package: 0603 (1608 Metric); Features: Automotive AEC-Q200; Height - Seated (Max): 0.022" (0.55mm); LastUpdated: 2/9/2024 8:43:33 PM; Lifecycle Status: Active; Minimum Order: 1; Number of Terminations: 2; Operating Temperature: -55°C ~ 155°C; Package / Case: 0603 (1608 Metric); Packaging: CutTape; PartId: 5841; Part Status: Active; Price: 0.01; Ratings: AEC-Q200; Resistance: 330 Ohms; Series: RMCF; Size / Dimension: 0.061" L x 0.031" W (1.55mm x 0.80mm); Supplier 1: DigiKey; Supplier Part Number 1: RMCF0603JT330RCT-ND; Supplier Device Package: 0603; Tolerance: ±5%
RO2 = ERA-3AED221V: as R4 on sheet MODULE_1; Part Number: ERA-3AED221V; Value: 220 Ohms; ComponentLink1Description: Datasheet; ComponentLink1URL: https://industrial.panasonic.com/cdbs/www-data/pdf/RDM0000/AOA0000C307.pdf; ComponentLink2Description: DigiKey Link; ComponentLink2URL: https://www.digikey.com/en/products/detail/panasonic-electronic-components/ERA-3AED221V/9373509; Composition: Thin Film; Device Package: 0603 (1608 Metric); Features: Automotive AEC-Q200; Height - Seated (Max): 0.022" (0.55mm); LastUpdated: 2/9/2024 8:43:36 PM; Lifecycle Status: Active; Minimum Order: 1; Number of Terminations: 2; Operating Temperature: -55°C ~ 155°C; Package / Case: 0603 (1608 Metric); Packaging: TapeAndReel; PartId: 4952; Part Status: Active; Price: 0.03; Ratings: AEC-Q200; Resistance: 220 Ohms; Series: ERA-3A; Size / Dimension: 0.063" L x 0.031" W (1.60mm x 0.80mm); Supplier 1: DigiKey; Supplier Part Number 1: P123752CT-ND; Supplier Device Package: 0603; Tolerance: ±0.5%
Y_D2 = XZMDK53W-8: as Y_D4 on sheet XOR_GATE; Part Number: XZMDK53W-8; Color: Red; ComponentLink1Description: Datasheet; ComponentLink1URL: https://www.sunledusa.com/products/spec/XZMDK53W-8.pdf; ComponentLink2Description: DigiKey Link; ComponentLink2URL: https://www.digikey.com/en/products/detail/sunled/XZMDK53W-8/4745952; Device Package: 0603 (1608 Metric); Height (Max): 0.95mm; LastUpdated: 6/3/2024 7:59:48 PM; Lens Transparency: Clear; Lifecycle Status: Active; Minimum Order: 1; Mounting Type: Surface Mount; Package / Case: 0603 (1608 Metric); Packaging: TapeAndReel; PartId: 401; Part Status: Active; Price: 0.06; Series: PixsoLED; Size / Dimension: 1.60mm L x 0.80mm W; Supplier 1: DigiKey; Supplier Part Number 1: 1497-1169-6-ND; Supplier Device Package: Chip LED; Value: Red

## Sheet AND_GATE.SchDoc
size A
Used 4 times, as channels U_AND_GATE_42, U_AND_GATE_43, U_AND_GATE_44, U_AND_GATE_45. Parts and nets are listed once, with the designators drawn on the sheet.
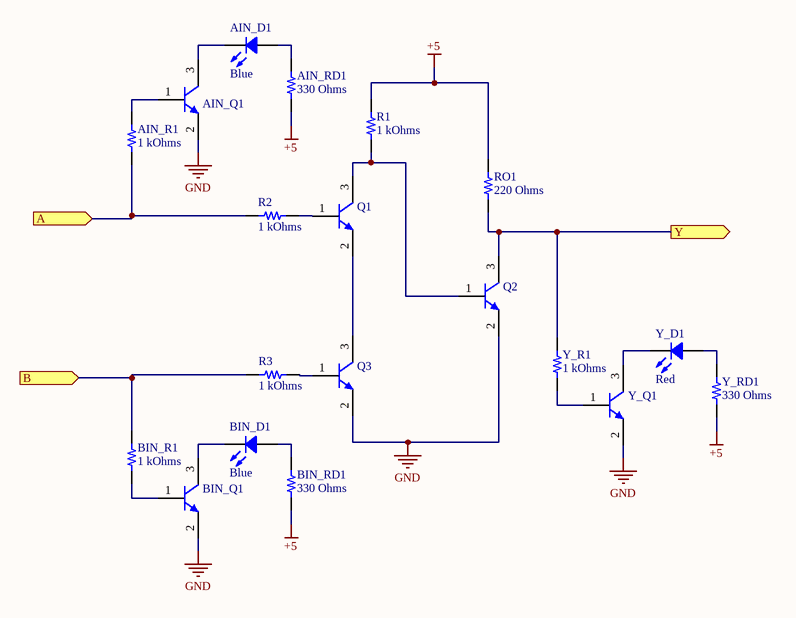
[diagram p4: AND_GATE.SchDoc]

### Parts
AIN_D1  Blue  [LED 0603_1608 BLUE]
AIN_Q1  MMSS8050-L-TP  [MCCSEMI SOT-23-3]  (value not drawn)
AIN_R1  1 kOhms  [RES 0603_1608]
AIN_RD1  330 Ohms  [RES 0603_1608]
BIN_D1  Blue  [LED 0603_1608 BLUE]
BIN_Q1  MMSS8050-L-TP  [MCCSEMI SOT-23-3]  (value not drawn)
BIN_R1  1 kOhms  [RES 0603_1608]
BIN_RD1  330 Ohms  [RES 0603_1608]
Q1  MMSS8050-L-TP  [MCCSEMI SOT-23-3]  (value not drawn)
Q2  MMSS8050-L-TP  [MCCSEMI SOT-23-3]  (value not drawn)
Q3  MMSS8050-L-TP  [MCCSEMI SOT-23-3]  (value not drawn)
R1  1 kOhms  [RES 0603_1608]
R2  1 kOhms  [RES 0603_1608]
R3  1 kOhms  [RES 0603_1608]
RO1  220 Ohms  [RES 0603_1608]
Y_D1  Red  [LED 0603_1608 RED]
Y_Q1  MMSS8050-L-TP  [MCCSEMI SOT-23-3]  (value not drawn)
Y_R1  1 kOhms  [RES 0603_1608]
Y_RD1  330 Ohms  [RES 0603_1608]

### Ports
A (in), B (in), Y (out)

### Nets
+5: AIN_RD1.1 BIN_RD1.1 R1.2 RO1.2 Y_RD1.1
GND: AIN_Q1.2(E) BIN_Q1.2(E) Q2.2(E) Q3.2(E) Y_Q1.2(E)
A: AIN_R1.2 R2.1 ; port A
B: BIN_R1.2 R3.1 ; port B
Y: Q2.3(C) RO1.1 Y_R1.2 ; port Y
NetAIN_D1_1: AIN_D1.1 AIN_RD1.2
NetAIN_D1_2: AIN_D1.2 AIN_Q1.3(C)
NetAIN_Q1_1: AIN_Q1.1(B) AIN_R1.1
NetBIN_D1_1: BIN_D1.1 BIN_RD1.2
NetBIN_D1_2: BIN_D1.2 BIN_Q1.3(C)
NetBIN_Q1_1: BIN_Q1.1(B) BIN_R1.1
NetQ1_1: Q1.1(B) R2.2
NetQ1_2: Q1.2(E) Q3.3(C)
NetQ1_3: Q1.3(C) Q2.1(B) R1.1
NetQ3_1: Q3.1(B) R3.2
NetY_D1_1: Y_D1.1 Y_RD1.2
NetY_D1_2: Y_D1.2 Y_Q1.3(C)
NetY_Q1_1: Y_Q1.1(B) Y_R1.1

### Channels
U_AND_GATE_42: designators end in _U_AND_GATE_42; ports A=NetAIN_R1_U_AND_GATE_42_2 B=NetAIN_R1_U_AND_GATE_45_2 Y=NetAIN_R3_U_NOT_GATE_53_2
U_AND_GATE_43: designators end in _U_AND_GATE_43; ports A=NetAIN_R1_U_AND_GATE_43_2 B=NetAIN_R4_U_XOR_GATE_20_2 Y=NetAIN_R3_U_NOT_GATE_54_2
U_AND_GATE_44: designators end in _U_AND_GATE_44; ports A=NetAIN_R1_U_AND_GATE_44_2 B=NetAIN_R1_U_AND_GATE_45_2 Y=NetAIN_R3_U_NOT_GATE_55_2
U_AND_GATE_45: designators end in _U_AND_GATE_45; ports A=NetAIN_R1_U_AND_GATE_45_2 B=NetBIN_R1_U_AND_GATE_45_2 Y=NetAIN_R3_U_NOT_GATE_56_2

### Library data of the parts
AIN_D1 BIN_D1 = IN-S63AT5B: as AIN_D4 on sheet XOR_GATE; Part Number: IN-S63AT5B; Color: Blue; ComponentLink1Description: Datasheet; ComponentLink1URL: http://www.inolux-corp.com/datasheet/SMDLED/Mono%20Color%20Top%20View/IN-S63AT%20Series_V1.1.pdf; ComponentLink2Description: DigiKey Link; ComponentLink2URL: https://www.digikey.com/en/products/detail/inolux/IN-S63AT5B/7604929; Device Package: 0603 (1608 Metric); Height (Max): 0.40mm; LastUpdated: 6/3/2024 7:57:52 PM; Lens Color: Clear; Lens Transparency: Clear; Lifecycle Status: Active; Minimum Order: 1; Mounting Type: Surface Mount; Package / Case: 0603 (1608 Metric); Packaging: TapeAndReel; PartId: 834; Part Status: Active; Price: 0.03; Series: IN-S63AT; Size / Dimension: 1.60mm L x 0.80mm W; Supplier 1: DigiKey; Supplier Part Number 1: 1830-1061-1-ND; Supplier Device Package: 0603; Value: Blue
AIN_Q1 BIN_Q1 Q1-Q3 Y_Q1 = MMSS8050-L-TP: as AIN_Q4 on sheet XOR_GATE; Part Number: MMSS8050-L-TP; ComponentLink1Description: Datasheet; ComponentLink1URL: https://www.mccsemi.com/pdf/Products/MMSS8050(SOT-23).pdf; ComponentLink2Description: DigiKey Link; ComponentLink2URL: https://www.digikey.com/en/products/detail/micro-commercial-co/MMSS8050-L-TP/2827197; Current - Collector (Ic) (Max): 1.5 A; LastUpdated: 6/3/2024 8:24:16 PM; Lifecycle Status: Active; Minimum Order: 1; Mounting Type: Surface Mount; Operating Temperature: -55°C ~ 150°C (TJ); Package / Case: TO-236-3, SC-59, SOT-23-3; Packaging: TapeAndReel; PartId: 278; Part Status: Active; Price: 0.01; Series: -; Supplier 1: DigiKey; Supplier Part Number 1: MMSS8050-L-TPMSCT-ND; Supplier Device Package: SOT-23; Transistor Type: NPN; Voltage - Collector Emitter Breakdown (Max): 25 V
AIN_R1 BIN_R1 R1-R3 Y_R1 = CPF0603B1K0E: as AIN_R4 on sheet XOR_GATE; Part Number: CPF0603B1K0E; Value: 1 kOhms; ComponentLink1Description: Datasheet; ComponentLink1URL: https://www.te.com/commerce/DocumentDelivery/DDEController?Action=srchrtrv&DocNm=1773200&DocType=DS&DocLang=English; ComponentLink2Description: DigiKey Link; ComponentLink2URL: https://www.digikey.com/en/products/detail/te-connectivity-passive-product/CPF0603B1K0E/2390473; Composition: Thin Film; Device Package: 0603 (1608 Metric); Height - Seated (Max): 0.022" (0.55mm); LastUpdated: 2/9/2024 8:43:37 PM; Lifecycle Status: Active; Minimum Order: 1; Number of Terminations: 2; Operating Temperature: -55°C ~ 155°C; Package / Case: 0603 (1608 Metric); Packaging: TapeAndReel; PartId: 4877; Part Status: Active; Price: 0.09; Resistance: 1 kOhms; Series: CPF, Neohm; Size / Dimension: 0.061" L x 0.031" W (1.55mm x 0.80mm); Supplier 1: DigiKey; Supplier Part Number 1: A119887CT-ND; Supplier Device Package: 0603; Tolerance: ±0.1%
AIN_RD1 BIN_RD1 Y_RD1 = RMCF0603JT330R: as AIN_RD4 on sheet XOR_GATE; Part Number: RMCF0603JT330R; Value: 330 Ohms; ComponentLink1Description: Datasheet; ComponentLink1URL: https://www.seielect.com/catalog/sei-rmcf_rmcp.pdf; ComponentLink2Description: DigiKey Link; ComponentLink2URL: https://www.digikey.com/en/products/detail/stackpole-electronics-inc/RMCF0603JT330R/1757998; Composition: Thick Film; Device Package: 0603 (1608 Metric); Features: Automotive AEC-Q200; Height - Seated (Max): 0.022" (0.55mm); LastUpdated: 2/9/2024 8:43:33 PM; Lifecycle Status: Active; Minimum Order: 1; Number of Terminations: 2; Operating Temperature: -55°C ~ 155°C; Package / Case: 0603 (1608 Metric); Packaging: CutTape; PartId: 5841; Part Status: Active; Price: 0.01; Ratings: AEC-Q200; Resistance: 330 Ohms; Series: RMCF; Size / Dimension: 0.061" L x 0.031" W (1.55mm x 0.80mm); Supplier 1: DigiKey; Supplier Part Number 1: RMCF0603JT330RCT-ND; Supplier Device Package: 0603; Tolerance: ±5%
RO1 = ERA-3AED221V: as R4 on sheet MODULE_1; Part Number: ERA-3AED221V; Value: 220 Ohms; ComponentLink1Description: Datasheet; ComponentLink1URL: https://industrial.panasonic.com/cdbs/www-data/pdf/RDM0000/AOA0000C307.pdf; ComponentLink2Description: DigiKey Link; ComponentLink2URL: https://www.digikey.com/en/products/detail/panasonic-electronic-components/ERA-3AED221V/9373509; Composition: Thin Film; Device Package: 0603 (1608 Metric); Features: Automotive AEC-Q200; Height - Seated (Max): 0.022" (0.55mm); LastUpdated: 2/9/2024 8:43:36 PM; Lifecycle Status: Active; Minimum Order: 1; Number of Terminations: 2; Operating Temperature: -55°C ~ 155°C; Package / Case: 0603 (1608 Metric); Packaging: TapeAndReel; PartId: 4952; Part Status: Active; Price: 0.03; Ratings: AEC-Q200; Resistance: 220 Ohms; Series: ERA-3A; Size / Dimension: 0.063" L x 0.031" W (1.60mm x 0.80mm); Supplier 1: DigiKey; Supplier Part Number 1: P123752CT-ND; Supplier Device Package: 0603; Tolerance: ±0.5%
Y_D1 = XZMDK53W-8: as Y_D4 on sheet XOR_GATE; Part Number: XZMDK53W-8; Color: Red; ComponentLink1Description: Datasheet; ComponentLink1URL: https://www.sunledusa.com/products/spec/XZMDK53W-8.pdf; ComponentLink2Description: DigiKey Link; ComponentLink2URL: https://www.digikey.com/en/products/detail/sunled/XZMDK53W-8/4745952; Device Package: 0603 (1608 Metric); Height (Max): 0.95mm; LastUpdated: 6/3/2024 7:59:48 PM; Lens Transparency: Clear; Lifecycle Status: Active; Minimum Order: 1; Mounting Type: Surface Mount; Package / Case: 0603 (1608 Metric); Packaging: TapeAndReel; PartId: 401; Part Status: Active; Price: 0.06; Series: PixsoLED; Size / Dimension: 1.60mm L x 0.80mm W; Supplier 1: DigiKey; Supplier Part Number 1: 1497-1169-6-ND; Supplier Device Package: Chip LED; Value: Red

## Sheet NAND_GATE.SchDoc
size A
Used 2 times, as channels U_NAND_GATE_10, U_NAND_GATE_40. Parts and nets are listed once, with the designators drawn on the sheet.
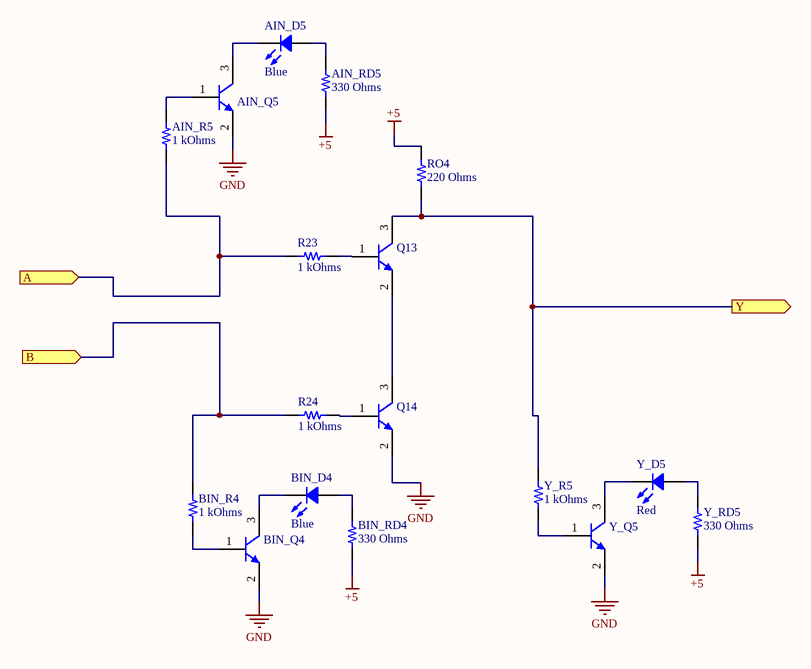
[diagram p5: NAND_GATE.SchDoc]

### Parts
AIN_D5  Blue  [LED 0603_1608 BLUE]
AIN_Q5  MMSS8050-L-TP  [MCCSEMI SOT-23-3]  (value not drawn)
AIN_R5  1 kOhms  [RES 0603_1608]
AIN_RD5  330 Ohms  [RES 0603_1608]
BIN_D4  Blue  [LED 0603_1608 BLUE]
BIN_Q4  MMSS8050-L-TP  [MCCSEMI SOT-23-3]  (value not drawn)
BIN_R4  1 kOhms  [RES 0603_1608]
BIN_RD4  330 Ohms  [RES 0603_1608]
Q13  MMSS8050-L-TP  [MCCSEMI SOT-23-3]  (value not drawn)
Q14  MMSS8050-L-TP  [MCCSEMI SOT-23-3]  (value not drawn)
R23  1 kOhms  [RES 0603_1608]
R24  1 kOhms  [RES 0603_1608]
RO4  220 Ohms  [RES 0603_1608]
Y_D5  Red  [LED 0603_1608 RED]
Y_Q5  MMSS8050-L-TP  [MCCSEMI SOT-23-3]  (value not drawn)
Y_R5  1 kOhms  [RES 0603_1608]
Y_RD5  330 Ohms  [RES 0603_1608]

### Ports
A (in), B (in), Y (out)

### Nets
+5: AIN_RD5.1 BIN_RD4.1 RO4.2 Y_RD5.1
GND: AIN_Q5.2(E) BIN_Q4.2(E) Q14.2(E) Y_Q5.2(E)
A: AIN_R5.2 R23.1 ; port A
B: BIN_R4.2 R24.1 ; port B
Y: Q13.3(C) RO4.1 Y_R5.2 ; port Y
NetAIN_D5_1: AIN_D5.1 AIN_RD5.2
NetAIN_D5_2: AIN_D5.2 AIN_Q5.3(C)
NetAIN_Q5_1: AIN_Q5.1(B) AIN_R5.1
NetBIN_D4_1: BIN_D4.1 BIN_RD4.2
NetBIN_D4_2: BIN_D4.2 BIN_Q4.3(C)
NetBIN_Q4_1: BIN_Q4.1(B) BIN_R4.1
NetQ13_1: Q13.1(B) R23.2
NetQ13_2: Q13.2(E) Q14.3(C)
NetQ14_1: Q14.1(B) R24.2
NetY_D5_1: Y_D5.1 Y_RD5.2
NetY_D5_2: Y_D5.2 Y_Q5.3(C)
NetY_Q5_1: Y_Q5.1(B) Y_R5.1

### Channels
U_NAND_GATE_10: designators end in _U_NAND_GATE_10; ports A=IN3 B=NetBIN_R2_U_OR_GATE_31_2 Y=NetAIN_R4_U_XOR_GATE_20_2
U_NAND_GATE_40: designators end in _U_NAND_GATE_40; ports A=NetAIN_R1_U_AND_GATE_43_2 B=IN3 Y=NetAIN_R3_U_NOT_GATE_51_2

### Library data of the parts
AIN_D5 BIN_D4 = IN-S63AT5B: as AIN_D4 on sheet XOR_GATE; Part Number: IN-S63AT5B; Color: Blue; ComponentLink1Description: Datasheet; ComponentLink1URL: http://www.inolux-corp.com/datasheet/SMDLED/Mono%20Color%20Top%20View/IN-S63AT%20Series_V1.1.pdf; ComponentLink2Description: DigiKey Link; ComponentLink2URL: https://www.digikey.com/en/products/detail/inolux/IN-S63AT5B/7604929; Device Package: 0603 (1608 Metric); Height (Max): 0.40mm; LastUpdated: 6/3/2024 7:57:52 PM; Lens Color: Clear; Lens Transparency: Clear; Lifecycle Status: Active; Minimum Order: 1; Mounting Type: Surface Mount; Package / Case: 0603 (1608 Metric); Packaging: TapeAndReel; PartId: 834; Part Status: Active; Price: 0.03; Series: IN-S63AT; Size / Dimension: 1.60mm L x 0.80mm W; Supplier 1: DigiKey; Supplier Part Number 1: 1830-1061-1-ND; Supplier Device Package: 0603; Value: Blue
AIN_Q5 BIN_Q4 Q13 Q14 Y_Q5 = MMSS8050-L-TP: as AIN_Q4 on sheet XOR_GATE; Part Number: MMSS8050-L-TP; ComponentLink1Description: Datasheet; ComponentLink1URL: https://www.mccsemi.com/pdf/Products/MMSS8050(SOT-23).pdf; ComponentLink2Description: DigiKey Link; ComponentLink2URL: https://www.digikey.com/en/products/detail/micro-commercial-co/MMSS8050-L-TP/2827197; Current - Collector (Ic) (Max): 1.5 A; LastUpdated: 6/3/2024 8:24:16 PM; Lifecycle Status: Active; Minimum Order: 1; Mounting Type: Surface Mount; Operating Temperature: -55°C ~ 150°C (TJ); Package / Case: TO-236-3, SC-59, SOT-23-3; Packaging: TapeAndReel; PartId: 278; Part Status: Active; Price: 0.01; Series: -; Supplier 1: DigiKey; Supplier Part Number 1: MMSS8050-L-TPMSCT-ND; Supplier Device Package: SOT-23; Transistor Type: NPN; Voltage - Collector Emitter Breakdown (Max): 25 V
AIN_R5 BIN_R4 R23 R24 Y_R5 = CPF0603B1K0E: as AIN_R4 on sheet XOR_GATE; Part Number: CPF0603B1K0E; Value: 1 kOhms; ComponentLink1Description: Datasheet; ComponentLink1URL: https://www.te.com/commerce/DocumentDelivery/DDEController?Action=srchrtrv&DocNm=1773200&DocType=DS&DocLang=English; ComponentLink2Description: DigiKey Link; ComponentLink2URL: https://www.digikey.com/en/products/detail/te-connectivity-passive-product/CPF0603B1K0E/2390473; Composition: Thin Film; Device Package: 0603 (1608 Metric); Height - Seated (Max): 0.022" (0.55mm); LastUpdated: 2/9/2024 8:43:37 PM; Lifecycle Status: Active; Minimum Order: 1; Number of Terminations: 2; Operating Temperature: -55°C ~ 155°C; Package / Case: 0603 (1608 Metric); Packaging: TapeAndReel; PartId: 4877; Part Status: Active; Price: 0.09; Resistance: 1 kOhms; Series: CPF, Neohm; Size / Dimension: 0.061" L x 0.031" W (1.55mm x 0.80mm); Supplier 1: DigiKey; Supplier Part Number 1: A119887CT-ND; Supplier Device Package: 0603; Tolerance: ±0.1%
AIN_RD5 BIN_RD4 Y_RD5 = RMCF0603JT330R: as AIN_RD4 on sheet XOR_GATE; Part Number: RMCF0603JT330R; Value: 330 Ohms; ComponentLink1Description: Datasheet; ComponentLink1URL: https://www.seielect.com/catalog/sei-rmcf_rmcp.pdf; ComponentLink2Description: DigiKey Link; ComponentLink2URL: https://www.digikey.com/en/products/detail/stackpole-electronics-inc/RMCF0603JT330R/1757998; Composition: Thick Film; Device Package: 0603 (1608 Metric); Features: Automotive AEC-Q200; Height - Seated (Max): 0.022" (0.55mm); LastUpdated: 2/9/2024 8:43:33 PM; Lifecycle Status: Active; Minimum Order: 1; Number of Terminations: 2; Operating Temperature: -55°C ~ 155°C; Package / Case: 0603 (1608 Metric); Packaging: CutTape; PartId: 5841; Part Status: Active; Price: 0.01; Ratings: AEC-Q200; Resistance: 330 Ohms; Series: RMCF; Size / Dimension: 0.061" L x 0.031" W (1.55mm x 0.80mm); Supplier 1: DigiKey; Supplier Part Number 1: RMCF0603JT330RCT-ND; Supplier Device Package: 0603; Tolerance: ±5%
RO4 = ERA-3AED221V: as R4 on sheet MODULE_1; Part Number: ERA-3AED221V; Value: 220 Ohms; ComponentLink1Description: Datasheet; ComponentLink1URL: https://industrial.panasonic.com/cdbs/www-data/pdf/RDM0000/AOA0000C307.pdf; ComponentLink2Description: DigiKey Link; ComponentLink2URL: https://www.digikey.com/en/products/detail/panasonic-electronic-components/ERA-3AED221V/9373509; Composition: Thin Film; Device Package: 0603 (1608 Metric); Features: Automotive AEC-Q200; Height - Seated (Max): 0.022" (0.55mm); LastUpdated: 2/9/2024 8:43:36 PM; Lifecycle Status: Active; Minimum Order: 1; Number of Terminations: 2; Operating Temperature: -55°C ~ 155°C; Package / Case: 0603 (1608 Metric); Packaging: TapeAndReel; PartId: 4952; Part Status: Active; Price: 0.03; Ratings: AEC-Q200; Resistance: 220 Ohms; Series: ERA-3A; Size / Dimension: 0.063" L x 0.031" W (1.60mm x 0.80mm); Supplier 1: DigiKey; Supplier Part Number 1: P123752CT-ND; Supplier Device Package: 0603; Tolerance: ±0.5%
Y_D5 = XZMDK53W-8: as Y_D4 on sheet XOR_GATE; Part Number: XZMDK53W-8; Color: Red; ComponentLink1Description: Datasheet; ComponentLink1URL: https://www.sunledusa.com/products/spec/XZMDK53W-8.pdf; ComponentLink2Description: DigiKey Link; ComponentLink2URL: https://www.digikey.com/en/products/detail/sunled/XZMDK53W-8/4745952; Device Package: 0603 (1608 Metric); Height (Max): 0.95mm; LastUpdated: 6/3/2024 7:59:48 PM; Lens Transparency: Clear; Lifecycle Status: Active; Minimum Order: 1; Mounting Type: Surface Mount; Package / Case: 0603 (1608 Metric); Packaging: TapeAndReel; PartId: 401; Part Status: Active; Price: 0.06; Series: PixsoLED; Size / Dimension: 1.60mm L x 0.80mm W; Supplier 1: DigiKey; Supplier Part Number 1: 1497-1169-6-ND; Supplier Device Package: Chip LED; Value: Red